# EAGLE schematic power_stage (EAGLE 7.2.0)
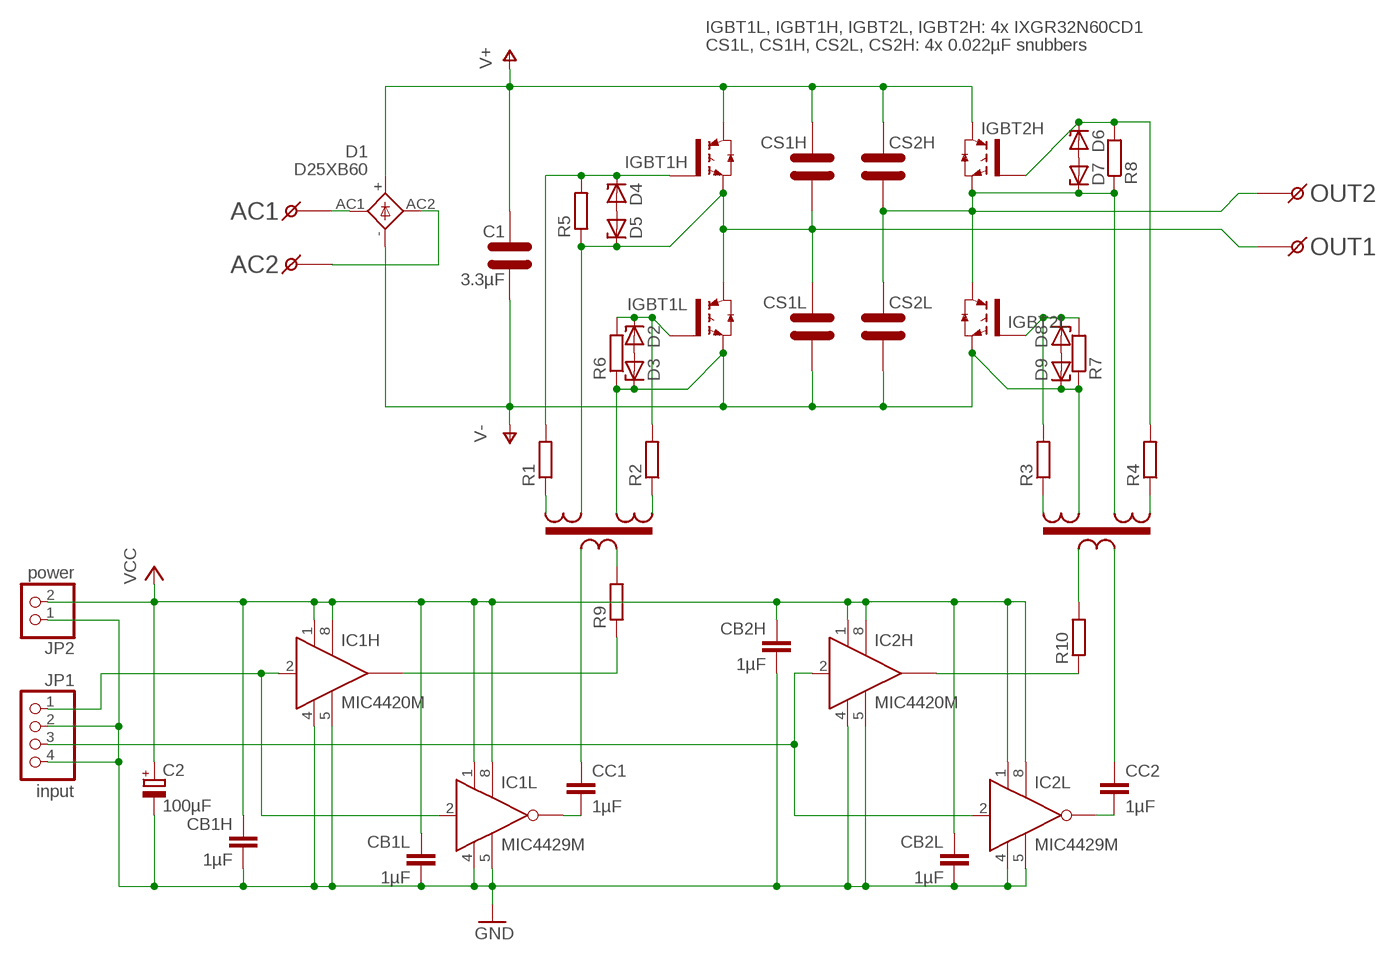
[diagram p0: schematic, sheet 1]

## Parts
C1  3.3µF  C_R75  [R75]
C2  100µF  CPOL-EUE2.5-7  [E2,5-7]
CB1H  1µF  C-EUC0805  [C0805]
CB1L  1µF  C-EUC0805  [C0805]
CB2H  1µF  C-EUC0805  [C0805]
CB2L  1µF  C-EUC0805  [C0805]
CC1  1µF  C-EUC0805  [C0805]
CC2  1µF  C-EUC0805  [C0805]
CS1H  C_R76  [R76]
CS1L  C_R76  [R76]
CS2H  C_R76  [R76]
CS2L  C_R76  [R76]
D1  D25XB60  [D25XB60]
D2  ZENER-DIODESOD80C  [SOD80C]
D3  ZENER-DIODESOD80C  [SOD80C]
D4  ZENER-DIODESOD80C  [SOD80C]
D5  ZENER-DIODESOD80C  [SOD80C]
D6  ZENER-DIODESOD80C  [SOD80C]
D7  ZENER-DIODESOD80C  [SOD80C]
D8  ZENER-DIODESOD80C  [SOD80C]
D9  ZENER-DIODESOD80C  [SOD80C]
GDT1  GDT  [GDT]
GDT2  GDT  [GDT]
IC1H  MIC4420M  [SO-08]
IC1L  MIC4429M  [SO-08]
IC2H  MIC4420M  [SO-08]
IC2L  MIC4429M  [SO-08]
IGBT1H  IXGR32N60CD1  [TO-247AD-V]
IGBT1L  IXGR32N60CD1  [TO-247AD-V]
IGBT2H  IXGR32N60CD1  [TO-247AD-V]
IGBT2L  IXGR32N60CD1  [TO-247AD-V]
J1  AC1  SCREW  [SCREW]
J2  AC2  SCREW  [SCREW]
J3  OUT1  SCREW  [SCREW]
J4  OUT2  SCREW  [SCREW]
JP1  input  PINHD-1X4  [1X04]
JP2  power  PINHD-1X2  [1X02]
R1  R-EU_R0805  [R0805]
R2  R-EU_R0805  [R0805]
R3  R-EU_R0805  [R0805]
R4  R-EU_R0805  [R0805]
R5  R-EU_R0805  [R0805]
R6  R-EU_R0805  [R0805]
R7  R-EU_R0805  [R0805]
R8  R-EU_R0805  [R0805]
R9  R-EU_R0805  [R0805]
R10  R-EU_R0805  [R0805]

## Nets
AC1: D1.AC1 J1.P$1 J1.P$2 J1.P$3 J1.P$4
AC2: D1.AC2 J2.P$1 J2.P$2 J2.P$3 J2.P$4
GND [control side]: C2.- CB1H.2 CB1L.2 CB2H.2 CB2L.2 IC1H.4(GND) IC1H.5(GND1) IC1L.4(GND) IC1L.5(GND1) IC2H.4(GND) IC2H.5(GND1) IC2L.4(GND) IC2L.5(GND1) JP1.2 JP1.4 JP2.1
N$1: GDT1.PB R9.2
N$2: IC1H.6(OUT) R9.1
N$3 [gate drive]: GDT1.S1A R1.1
N$4: IC2H.6(OUT) R10.1
N$5: GDT2.PB R10.2
N$6 [gate drive]: D2.C IGBT1L.G R2.2 R6.2
N$7 [gate drive]: GDT1.S2B R2.1
N$10 [gate drive]: D8.C IGBT2L.G R3.2 R7.2
N$11 [gate drive]: D4.C IGBT1H.G R1.2 R5.2
N$12 [gate drive]: GDT2.S2B R3.1
N$13 [gate drive]: GDT2.S1A R4.1
N$14 [gate drive]: D6.C IGBT2H.G R4.2 R8.2
N$15 [control side]: IC1H.2(IN) IC1L.2(IN) JP1.1
N$17: D2.A D3.A
N$19: D4.A D5.A
N$20 [control side]: IC2H.2(IN) IC2L.2(IN) JP1.3
N$22 [control side]: CC1.2 IC1L.6(OUT)
N$23: D6.A D7.A
N$24: D8.A D9.A
N$25 [control side]: CC2.2 IC2L.6(OUT)
N$26 [control side]: CC1.1 GDT1.PA
N$27 [control side]: CC2.1 GDT2.PA
OUT1: CS1H.P$1 CS1L.P$2 D5.C GDT1.S1B IGBT1H.S(E) IGBT1L.D(C) J3.P$1 J3.P$2 J3.P$3 J3.P$4 R5.1
OUT2: CS2H.P$1 CS2L.P$2 D7.C GDT2.S1B IGBT2H.S(E) IGBT2L.D(C) J4.P$1 J4.P$2 J4.P$3 J4.P$4 R8.1
V+: C1.P$2 CS1H.P$2 CS2H.P$2 D1.+ IGBT1H.D(C) IGBT2H.D(C)
V-: C1.P$1 CS1L.P$1 CS2L.P$1 D1.- D3.C D9.C GDT1.S2A GDT2.S2A IGBT1L.S(E) IGBT2L.S(E) R6.1 R7.1
VCC [control side]: C2.+ CB1H.1 CB1L.1 CB2H.1 CB2L.1 IC1H.1(VS) IC1H.8(VS1) IC1L.1(VS) IC1L.8(VS1) IC2H.1(VS) IC2H.8(VS1) IC2L.1(VS) IC2L.8(VS1) JP2.2
Unconnected: IC1H.7(OUT) IC1L.7(OUT) IC2H.7(OUT) IC2L.7(OUT)

## Notes on the sheet
- IGBT1L, IGBT1H, IGBT2L, IGBT2H: 4x IXGR32N60CD1
- CS1L, CS1H, CS2L, CS2H: 4x 0.022µF snubbers

## Library data of the parts
C1 CS1H CS1L CS2H CS2L = induction-heater:C
C2 = rcl:CPOL-EU: POLARIZED CAPACITOR, European symbol
CB1H CB1L CB2H CB2L CC1 CC2 = rcl:C-EU: CAPACITOR, European symbol
D1 = induction-heater:D25XB60
D2-D9 = diode:ZENER-DIODE: Z-Diode
GDT1 GDT2 = induction-heater:GDT
IC1H IC2H = transistor-power:MIC4420: 6A-Peak Low-Side MOSFET Driver Bipolar/CMOS/DMOS Process http://www.micrel.com/_PDF/mic4420.pdf
IC1L IC2L = transistor-power:MIC4429: 6A-Peak Low-Side MOSFET Driver (INVERTED) Bipolar/CMOS/DMOS Process http://www.micrel.com/_PDF/mic4420.pdf
IGBT1H IGBT1L IGBT2H IGBT2L = induction-heater:IXGR32N60CD1: HiPerFAST™ IGBT with diode ISOPLUS247™
J1-J4 = induction-heater:SCREW
JP1 = pinhead:PINHD-1X4: PIN HEADER
JP2 = pinhead:PINHD-1X2: PIN HEADER
R1-R10 = rcl:R-EU_: RESISTOR, European symbol